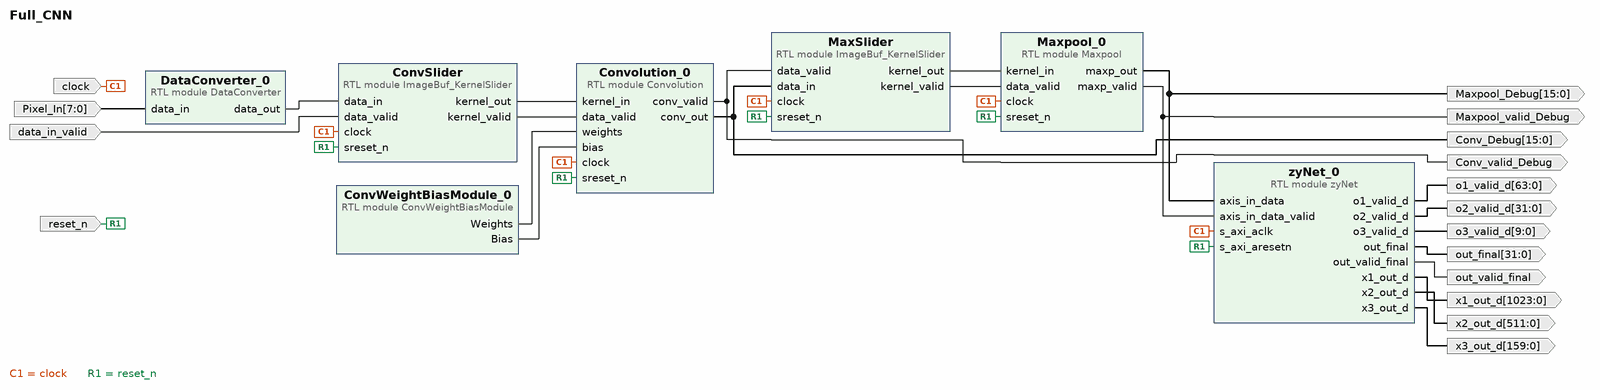
[diagram p0: block diagram of the top level]
# Vivado block design Full_CNN, xc7z020clg484-1, Vivado 2020.2
create_bd_design Full_CNN

create_bd_port -dir I -from 7 -to 0 Pixel_In
create_bd_port -dir I -type clk clock
create_bd_port -dir I data_in_valid
create_bd_port -dir I reset_n
create_bd_port -dir O -from 1023 -to 0 x1_out_d
create_bd_port -dir O -from 63 -to 0 o1_valid_d
create_bd_port -dir O -from 511 -to 0 x2_out_d
create_bd_port -dir O -from 31 -to 0 o2_valid_d
create_bd_port -dir O -from 159 -to 0 x3_out_d
create_bd_port -dir O out_valid_final
create_bd_port -dir O -from 9 -to 0 o3_valid_d
create_bd_port -dir O -from 31 -to 0 out_final
create_bd_port -dir O -from 15 -to 0 Maxpool_Debug
create_bd_port -dir O Maxpool_valid_Debug
create_bd_port -dir O Conv_valid_Debug
create_bd_port -dir O -from 15 -to 0 Conv_Debug

create_bd_cell -type module -reference Convolution Convolution_0
set_property -dict {CONFIG.ACTIVATION 1} [get_bd_cells Convolution_0]
create_bd_cell -type module -reference Maxpool Maxpool_0
create_bd_cell -type module -reference ImageBuf_KernelSlider ConvSlider
set_property -dict {CONFIG.COLUMN_NUM 28 CONFIG.DATA_WIDTH 16 CONFIG.ROW_NUM 28} [get_bd_cells ConvSlider]
create_bd_cell -type module -reference ConvWeightBiasModule ConvWeightBiasModule_0
create_bd_cell -type module -reference ImageBuf_KernelSlider MaxSlider
set_property -dict [list \
  CONFIG.COLUMN_NUM 26 \
  CONFIG.DATA_WIDTH 16 \
  CONFIG.KERNEL_SIZE 2 \
  CONFIG.ROW_NUM 26 \
  CONFIG.STRIDE 2 \
] [get_bd_cells MaxSlider]
create_bd_cell -type module -reference DataConverter DataConverter_0
create_bd_cell -type module -reference zyNet zyNet_0

# ---- connections ----

connect_bd_net -net DataConverter_0_out [get_bd_pins DataConverter_0/data_out] [get_bd_pins ConvSlider/data_in]
connect_bd_net -net in_0_1 [get_bd_ports Pixel_In] [get_bd_pins DataConverter_0/data_in]
connect_bd_net -net clock_0_1 [get_bd_ports clock] \
  [get_bd_pins ConvSlider/clock] [get_bd_pins Convolution_0/clock] [get_bd_pins Maxpool_0/clock] \
  [get_bd_pins MaxSlider/clock] [get_bd_pins zyNet_0/s_axi_aclk]
connect_bd_net -net data_valid_0_1 [get_bd_ports data_in_valid] [get_bd_pins ConvSlider/data_valid]
connect_bd_net [get_bd_pins ConvSlider/kernel_out] [get_bd_pins Convolution_0/kernel_in]
connect_bd_net [get_bd_pins ConvSlider/kernel_valid] [get_bd_pins Convolution_0/data_valid]
connect_bd_net [get_bd_pins zyNet_0/x1_out_d] [get_bd_ports x1_out_d]
connect_bd_net [get_bd_pins zyNet_0/o1_valid_d] [get_bd_ports o1_valid_d]
connect_bd_net [get_bd_pins zyNet_0/x2_out_d] [get_bd_ports x2_out_d]
connect_bd_net [get_bd_pins zyNet_0/o2_valid_d] [get_bd_ports o2_valid_d]
connect_bd_net [get_bd_pins zyNet_0/x3_out_d] [get_bd_ports x3_out_d]
connect_bd_net [get_bd_pins zyNet_0/out_valid_final] [get_bd_ports out_valid_final]
connect_bd_net [get_bd_pins zyNet_0/o3_valid_d] [get_bd_ports o3_valid_d]
connect_bd_net [get_bd_pins zyNet_0/out_final] [get_bd_ports out_final]
connect_bd_net [get_bd_pins MaxSlider/kernel_out] [get_bd_pins Maxpool_0/kernel_in]
connect_bd_net [get_bd_pins MaxSlider/kernel_valid] [get_bd_pins Maxpool_0/data_valid]
connect_bd_net [get_bd_pins ConvWeightBiasModule_0/Weights] [get_bd_pins Convolution_0/weights]
connect_bd_net [get_bd_pins ConvWeightBiasModule_0/Bias] [get_bd_pins Convolution_0/bias]
connect_bd_net [get_bd_ports reset_n] \
  [get_bd_pins ConvSlider/sreset_n] [get_bd_pins Convolution_0/sreset_n] [get_bd_pins MaxSlider/sreset_n] \
  [get_bd_pins Maxpool_0/sreset_n] [get_bd_pins zyNet_0/s_axi_aresetn]
connect_bd_net [get_bd_pins Maxpool_0/maxp_out] [get_bd_ports Maxpool_Debug] [get_bd_pins zyNet_0/axis_in_data]
connect_bd_net [get_bd_pins Maxpool_0/maxp_valid] [get_bd_ports Maxpool_valid_Debug] [get_bd_pins zyNet_0/axis_in_data_valid]
connect_bd_net [get_bd_pins Convolution_0/conv_valid] [get_bd_ports Conv_valid_Debug] [get_bd_pins MaxSlider/data_valid]
connect_bd_net [get_bd_pins Convolution_0/conv_out] [get_bd_ports Conv_Debug] [get_bd_pins MaxSlider/data_in]

validate_bd_design
save_bd_design
